# EasyEDA schematic SCH_simple-car_2026-01-17.json
TITLE: Sheet_1; REV: 1.0; Date: 2026-01-16; Sheet: 1/1; Drawn By: johnkotsis; Company: Your Company
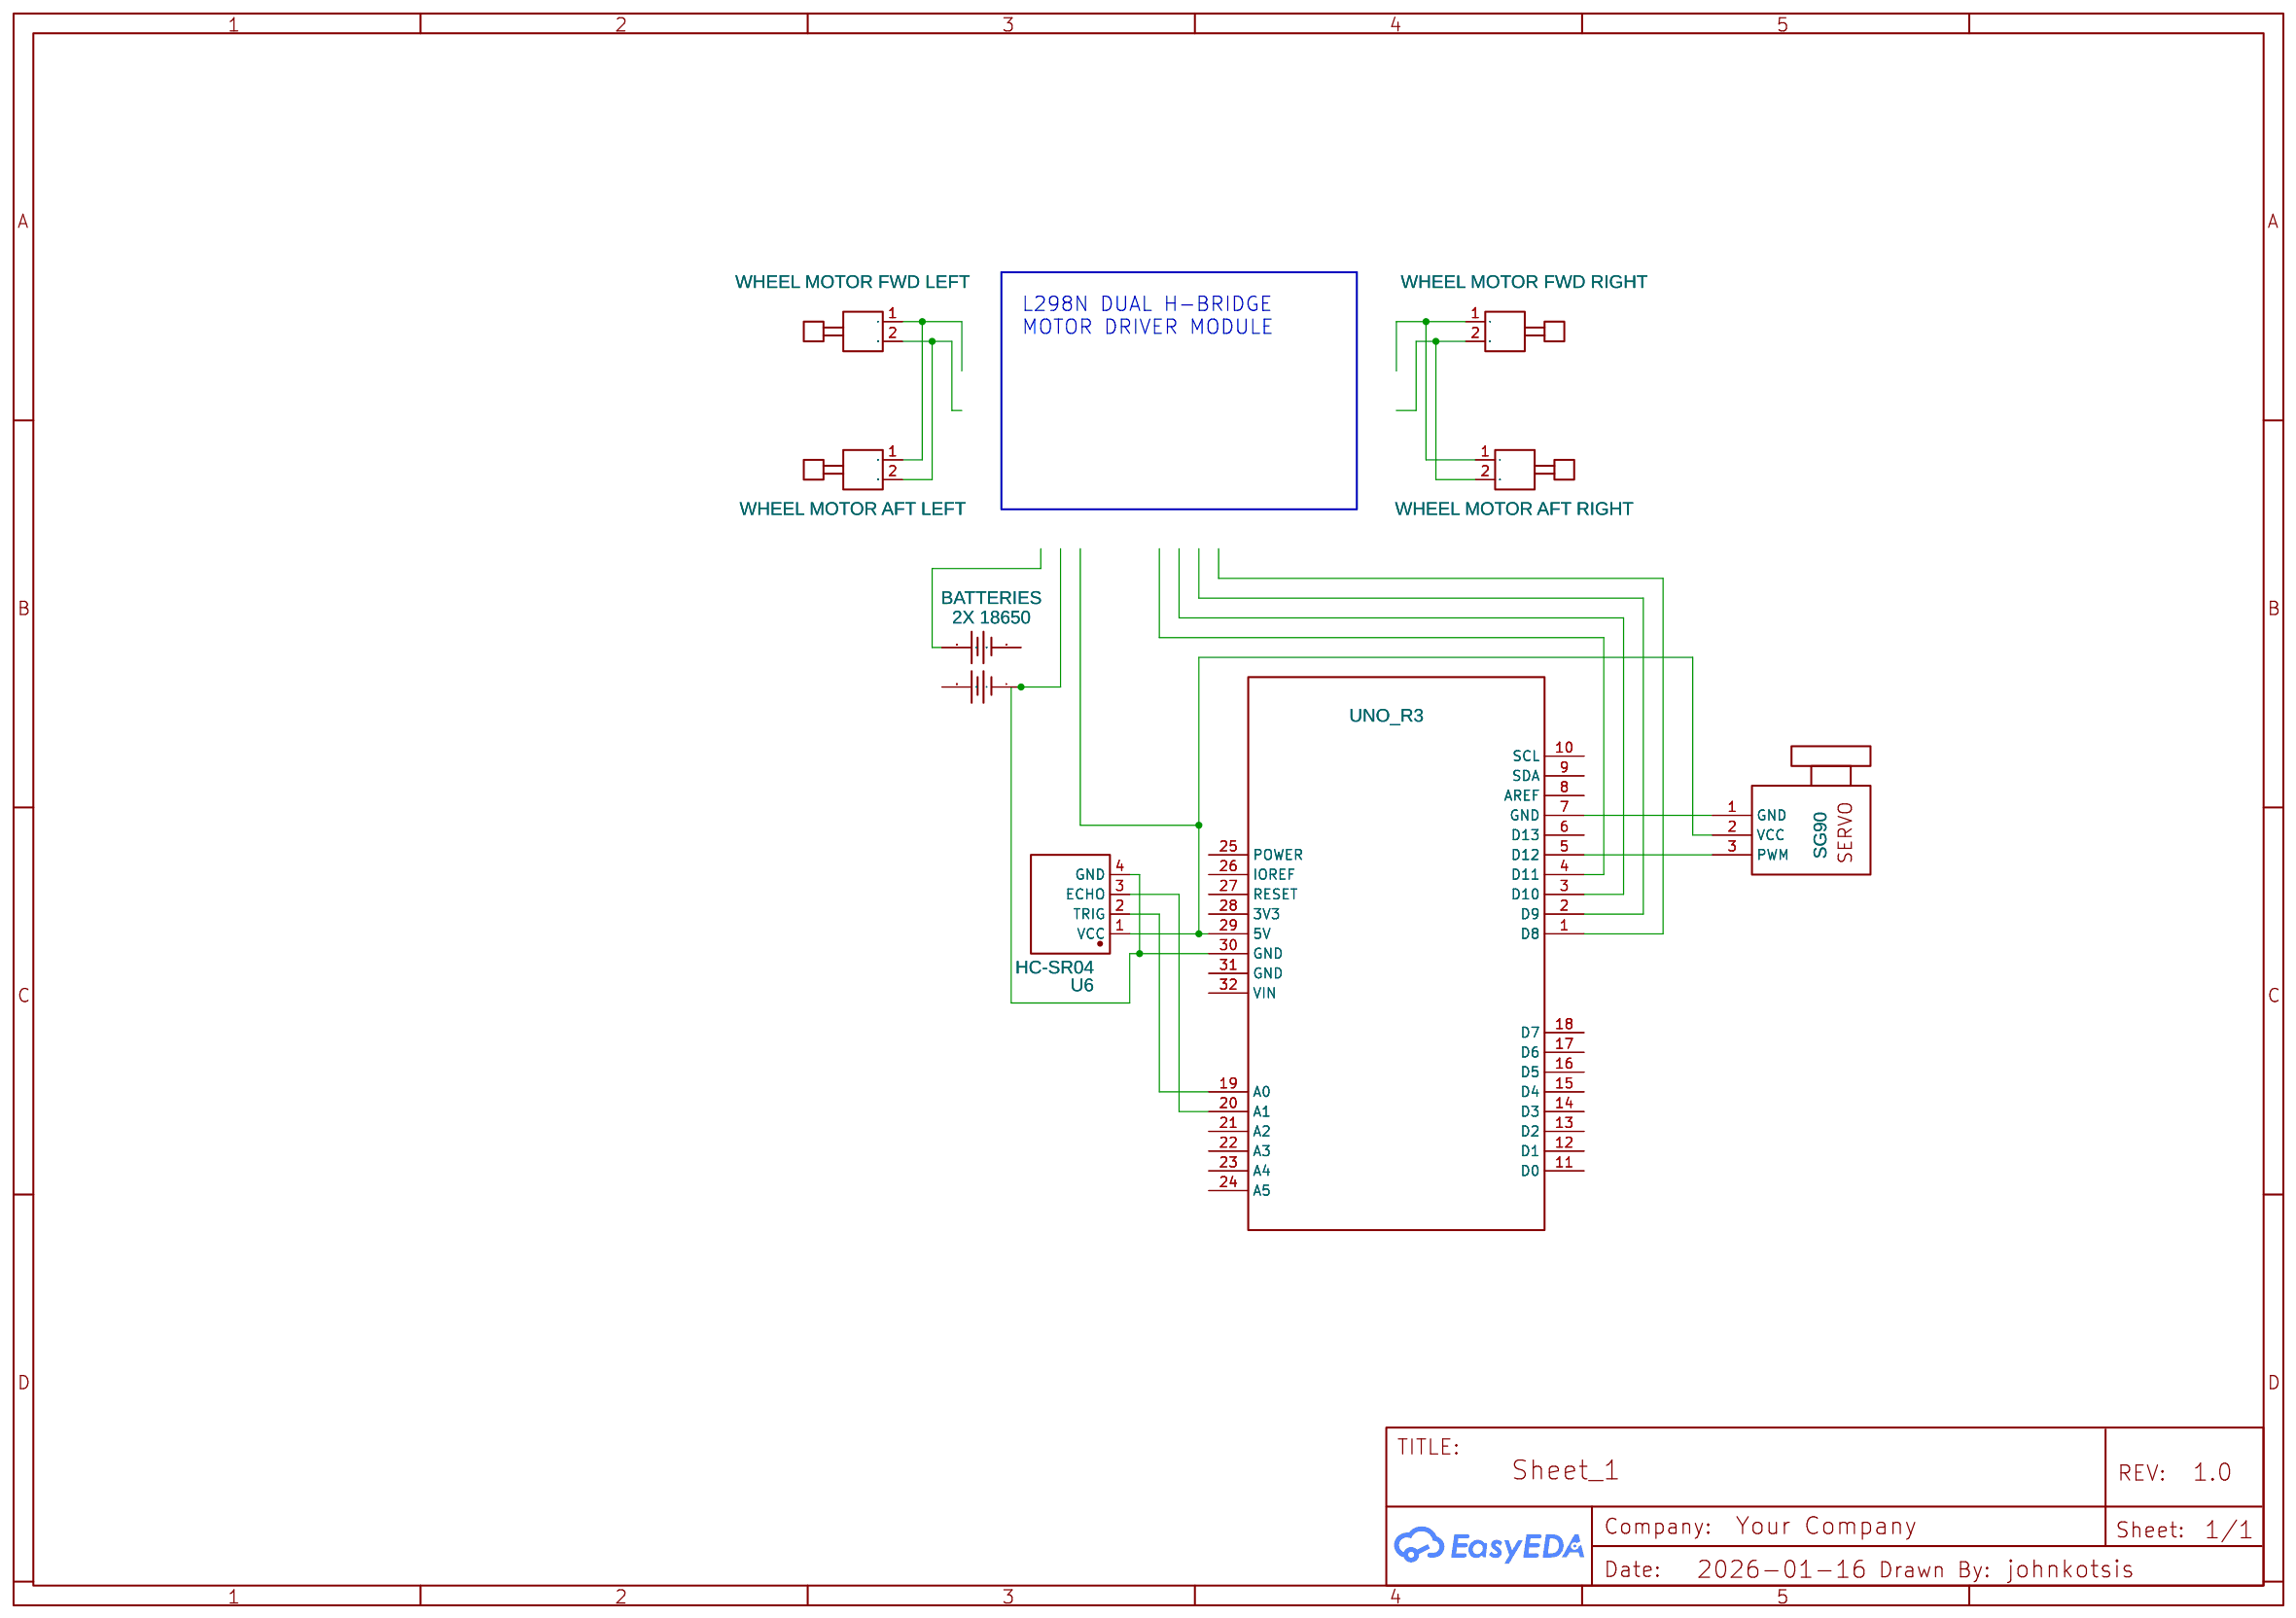
[diagram p0: schematic sheet]

## Parts
BATTERIES  2X 18650  [BAT-TH_BH-18650-A1BJ034]
P1  UNO_R3  [UNO_R3]
U1  SG90  [NEWSERVOPCB]
U2  WHEEL MOTOR FWD LEFT  [MOTOR_LCM04084521-B1]
U3  WHEEL MOTOR FWD RIGHT  [MOTOR_LCM04084521-B1]
U4  WHEEL MOTOR AFT LEFT  [MOTOR_LCM04084521-B1]
U5  WHEEL MOTOR AFT RIGHT  [MOTOR_LCM04084521-B1]
U6  HC-SR04  [TH_HC-SR04V]

## Library data of the parts
BATTERIES = BH-18650-A1BJ034: Supplier: LCSC; Supplier Part: C49215506; Manufacturer: MYOUNG(美阳); JLCPCB Part Class: Extended Part; Contributor: lcsc
P1 = UNO_R3: sourceId: 1T5FDZYC8
U1 = SERVO MG995 COPY: Manufacturer Part: ServoMotor; Contributor: matekf97
U2-U5 = LCM04084521-B1: Supplier: LCSC; Supplier Part: C2992359; Manufacturer: LEADER(立得); JLCPCB Part Class: Extended Part; Contributor: lcsc
U6 = HC-SR04: Supplier: LCSC; Supplier Part: C19857336; Manufacturer: Universal Microelectronics; Contributor: lcsc; JLCPCB Part Class: Extended Part

## Nets
Net-(BATTERIES-4): BATTERIES.4 P1.30(GND) U6.4(GND)
Net-(P1-5): P1.5(D12) U1.3(PWM)
Net-(P1-7): P1.7(GND) U1.1(GND)
Net-(P1-19): P1.19(A0) U6.2(TRIG)
Net-(P1-20): P1.20(A1) U6.3(ECHO)
Net-(P1-29): P1.29(5V) U1.2(VCC) U6.1(VCC)
Net-(U2-1): U2.1 U4.1
Net-(U2-2): U2.2 U4.2
Net-(U3-1): U3.1 U5.1
Net-(U3-2): U3.2 U5.2

Not connected (* = marked no-connect by the designer): BATTERIES 1 2 3; P1 1(D8) 2(D9) 3(D10) 4(D11) 6(D13) 8(AREF) 9(SDA) 10(SCL) 11(D0) 12(D1) 13(D2) 14(D3) 15(D4) 16(D5) 17(D6) 18(D7) 21(A2) 22(A3) 23(A4) 24(A5) 25(POWER) 26(IOREF) 27(RESET) 28(3V3) 31(GND) 32(VIN)

## Notes on the sheet
- L298N DUAL H-BRIDGE
  MOTOR DRIVER MODULE
